# EAGLE schematic RFID_Controller (EAGLE 7.2.0)
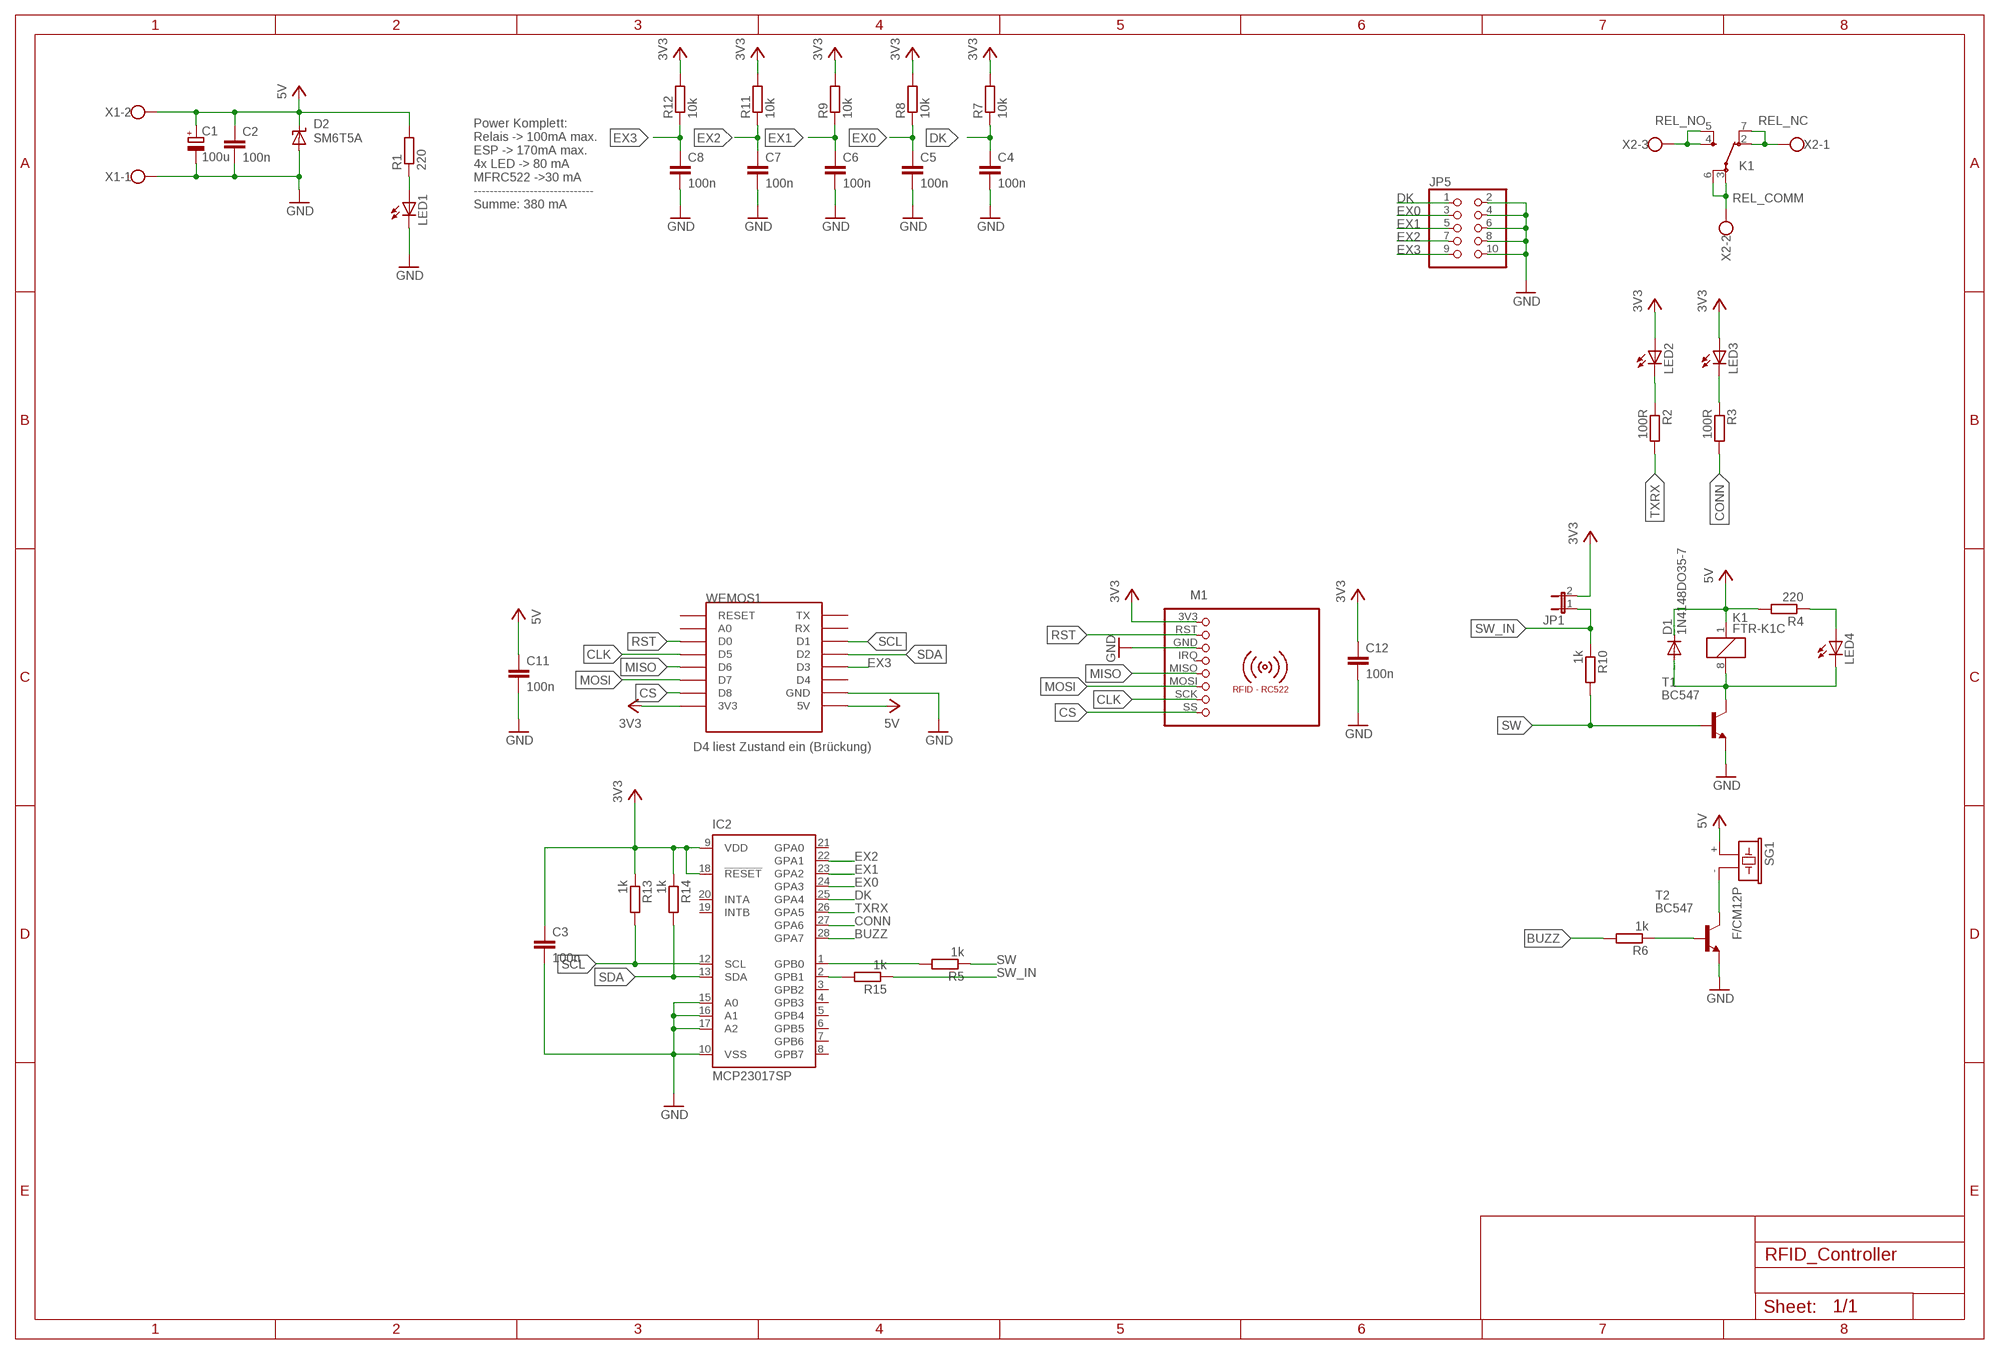
[diagram p0: schematic, sheet 1]

## Parts
C1  100u  CPOL-EUE2.5-7  [E2,5-7]
C2  100n  C-EU050-025X075  [C050-025X075]
C3  100n  C-EU050-025X075  [C050-025X075]
C4  100n  C-EU050-025X075  [C050-025X075]
C5  100n  C-EU050-025X075  [C050-025X075]
C6  100n  C-EU050-025X075  [C050-025X075]
C7  100n  C-EU050-025X075  [C050-025X075]
C8  100n  C-EU050-025X075  [C050-025X075]
C11  100n  C-EU050-025X075  [C050-025X075]
C12  100n  C-EU050-025X075  [C050-025X075]
D1  1N4148DO35-7  [DO35-7]
D2  SM6T5A  SUPPRESSOR-SMBJ  [SMBJ]
IC2  MCP23017SP  [DIL28-3]
JP1  JP1E  [JP1]
JP5  PINHD-2X5  [2X05]
K1  FTR-K1C  [FTR-K1C]
LED1  LED3MM  [LED3MM]
LED2  LED3MM  [LED3MM]
LED3  LED3MM  [LED3MM]
LED4  LED3MM  [LED3MM]
M1  RFID-RC522  [RFID-RC522]
R1  220  R-EU_0204/7  [0204/7]
R2  100R  R-EU_0204/7  [0204/7]
R3  100R  R-EU_0204/7  [0204/7]
R4  220  R-EU_0204/7  [0204/7]
R5  1k  R-EU_0204/7  [0204/7]
R6  1k  R-EU_0204/7  [0204/7]
R7  10k  R-EU_0204/7  [0204/7]
R8  10k  R-EU_0204/7  [0204/7]
R9  10k  R-EU_0204/7  [0204/7]
R10  1k  R-EU_0204/7  [0204/7]
R11  10k  R-EU_0204/7  [0204/7]
R12  10k  R-EU_0204/7  [0204/7]
R13  1k  R-EU_0204/7  [0204/7]
R14  1k  R-EU_0204/7  [0204/7]
R15  1k  R-EU_0204/7  [0204/7]
SG1  F/CM12P  [F/CM12P]
T1  BC547  [TO92]
T2  BC547  [TO92]
WEMOS1  WEMOS-D1-MINI  [WEMOS-D1-MINI]
X1  W237-102  [W237-102]
X2  W237-103  [W237-103]

## Nets
3V3: C3.1 C12.1 IC2.9(VDD) IC2.18(!RESET) JP1.2 LED2.A LED3.A M1.3V3 R7.2 R8.2 R9.2 R11.2 R12.2 R13.1 R14.1 WEMOS1.3V3
5V: C1.+ C2.1 C11.1 D1.C D2.C K1.1 R1.2 R4.2 SG1.+ WEMOS1.5V X1.2
BUZZ: IC2.28(GPA7) R6.2
CLK: M1.SCK WEMOS1.D5
CONN: IC2.27(GPA6) R3.2
CS: M1.SS WEMOS1.D8
DK: C4.1 IC2.25(GPA4) JP5.1 R7.1
EX0: C5.1 IC2.24(GPA3) JP5.3 R8.1
EX1: C6.1 IC2.23(GPA2) JP5.5 R9.1
EX2: C7.1 IC2.22(GPA1) JP5.7 R11.1
EX3: C8.1 JP5.9 R12.1 WEMOS1.D3
GND: C1.- C2.2 C3.2 C4.2 C5.2 C6.2 C7.2 C8.2 C11.2 C12.2 D2.A IC2.10(VSS) IC2.15(A0) IC2.16(A1) IC2.17(A2) JP5.2 JP5.4 JP5.6 JP5.8 JP5.10 LED1.K(C) M1.GND T1.1(E) T2.1(E) WEMOS1.GND X1.1
MISO: M1.MISO WEMOS1.D6
MOSI: M1.MOSI WEMOS1.D7
N$1: LED1.A R1.1
N$2: LED2.K(C) R2.1
N$3: LED3.K(C) R3.1
N$4: LED4.A R4.1
N$5: D1.A K1.8 LED4.K(C) T1.3(C)
N$6: R6.1 T2.2(B)
N$7: SG1.- T2.3(C)
N$8: IC2.1(GPB0) R5.2
REL_COMM [HV]: K1.3(-1:PA) K1.6(-1:PB) X2.2
REL_NC [HV]: K1.2(-1:OA) K1.7(-1:OB) X2.1
REL_NO [HV]: K1.4(-1:SA) K1.5(-1:SB) X2.3
RST: M1.RST WEMOS1.D0
SCL: IC2.12(SCL) R13.2 WEMOS1.D1
SDA: IC2.13(SDA) R14.2 WEMOS1.D2
SW: IC2.2(GPB1) R5.1 R10.2 R15.2 T1.2(B)
SW_IN: JP1.1 R10.1 R15.1
TXRX: IC2.26(GPA5) R2.2
Unconnected: IC2.3(GPB2) IC2.4(GPB3) IC2.5(GPB4) IC2.6(GPB5) IC2.7(GPB6) IC2.8(GPB7) IC2.19(INTB) IC2.20(INTA) IC2.21(GPA0) M1.IRQ WEMOS1.A0 WEMOS1.D4 WEMOS1.RESET WEMOS1.RX WEMOS1.TX

## Notes on the sheet
- Power Komplett:
  Relais -> 100mA max.
  ESP -> 170mA max.
  4x LED -> 80 mA
  MFRC522 ->30 mA
  ------------------------------
  Summe: 380 mA
- D4 liest Zustand ein (Brückung)

## Library data of the parts
C1 = rcl:CPOL-EU: POLARIZED CAPACITOR, European symbol
C2-C8 C11 C12 = rcl:C-EU: CAPACITOR, European symbol
D1 = diode:1N4148: DIODE high speed (Philips)
D2 = diode:SUPPRESSOR-: Suppressor diode
IC2 = microchip:MCP23017: http://ww1.microchip.com/downloads/en/DeviceDoc/21952a.pdf Source: http://ww1.microchip.com/downloads/en/DeviceDoc/21952a.pdf; MF: MICROCHIP; MPN: MCP23017-E/SP; OC_FARNELL: 1332088; OC_NEWARK: 31K2959
JP1 = jumper:JP1E: JUMPER
JP5 = pinhead:PINHD-2X5: PIN HEADER
K1 = relay:FTR-K1C: NETZRELAIS FTR-K1CK024W1XUM 16A/250VAC 1 Umschaltkontakt Distributor: Conrad Electronic Bestell Nr.: 504389-13 - 24V Source: http://www.produktinfo.conrad.com/datenblaetter/500000-524999/504384-da-01-de-NETZRELAIS_FTR_K1CK012W1XUM_16A_250VAC.pdf; OC_FARNELL: unknown; OC_NEWARK: unknown
LED1-LED4 = led:LED: LED OSRAM: - CHIPLED LG R971, LG N971, LY N971, LG Q971, LY Q971, LO R971, LY R971 LH N974, LH R974 LS Q976, LO Q976, LY Q976 LO Q996 - Hyper CHIPLED LW Q18S LB Q993, LB Q99A, LB R99A - SideLED LS A670, LO A670, LY A670, LG A670, LP A670 LB A673, LV A673, LT A673, LW A673 LH A674 LY A675 LS A676, LA A676, LO A676, LY A676, LW A676 LS A679, LY A679, LG A679 - Hyper Micro SIDELED® LS Y876, LA Y876, LO Y876, LY Y876 LT Y87S - SmartLED LW L88C, LW L88S LB L89C, LB L89S, LG L890 LS L89K, LO L89K, LY L89K LS L896, LA L896, LO L896, LY L896 - TOPLED LS T670, LO T670, LY T670, LG T670, LP T670 LSG T670, LSP T670, LSY T670, LOP T670, LYG T670 LG T671, LOG T671, LSG T671 LB T673, LV T673, LT T673, LW T673 LH T674 LS T676, LA T676, LO T676, LY T676, LB T676, LH T676, LSB T676, LW T676 LB T67C, LV T67C, LT T67C, LS T67K, LO T67K, LY T67K, LW E67C LS E67B, LA E67B, LO E67B, LY E67B, LB E67C, LV E67C, LT E67C LW T67C LS T679, LY T679, LG T679 LS T770, LO T770, LY T770, LG T770, LP T770 LB T773, LV T773, LT T773, LW T773 LH T774 LS E675, LA E675, LY E675, LS T675 LS T776, LA T776, LO T776, LY T776, LB T776 LHGB T686 LT T68C, LB T68C - Hyper Mini TOPLED® LB M676 - Mini TOPLED Santana® LG M470 LS M47K, LO M47K, LY M47K Source: http://www.osram.convergy.de LUXEON: - LUMILED® LXK2-PW12-R00, LXK2-PW12-S00, LXK2-PW14-U00, LXK2-PW14-V00 LXK2-PM12-R00, LXK2-PM12-S00, LXK2-PM14-U00 LXK2-PE12-Q00, LXK2-PE12-R00, LXK2-PE12-S00, LXK2-PE14-T00, LXK2-PE14-U00 LXK2-PB12-K00, LXK2-PB12-L00, LXK2-PB12-M00, LXK2-PB14-N00, LXK2-PB14-P00, LXK2-PB14-Q00 LXK2-PR12-L00, LXK2-PR12-M00, LXK2-PR14-Q00, LXK2-PR14-R00 LXK2-PD12-Q00, LXK2-PD12-R00, LXK2-PD12-S00 LXK2-PH12-R00, LXK2-PH12-S00 LXK2-PL12-P00, LXK2-PL12-Q00, LXK2-PL12-R00 Source: www.luxeon.com KINGBRIGHT: KA-3528ASYC Source: www.kingbright.com
M1 = mfrc522-module:RFID-RC522: RFID-RC522 MFRC-522 based breakout board
R1-R15 = rcl:R-EU_: RESISTOR, European symbol
SG1 = buzzer:F/CM12P: BUZZER Source: Buerklin; OC_FARNELL: unknown; OC_NEWARK: unknown
T1 T2 = transistor:BC547: NPN TRANSISTOR
WEMOS1 = esp8266modules:WEMOS-D1-MINI: WeMos.cc D1 mini ESP8266 module
X1 = con-wago-500:W237-102: WAGO SCREW CLAMP; MPN: 237-102; OC_FARNELL: unknown; OC_NEWARK: 70K9898
X2 = con-wago-500:W237-103: WAGO SCREW CLAMP; MPN: 237-103; OC_FARNELL: unknown; OC_NEWARK: 18M7116

## Net classes
1 HV: clearance 5 mm to class 0, clearance 1 mm